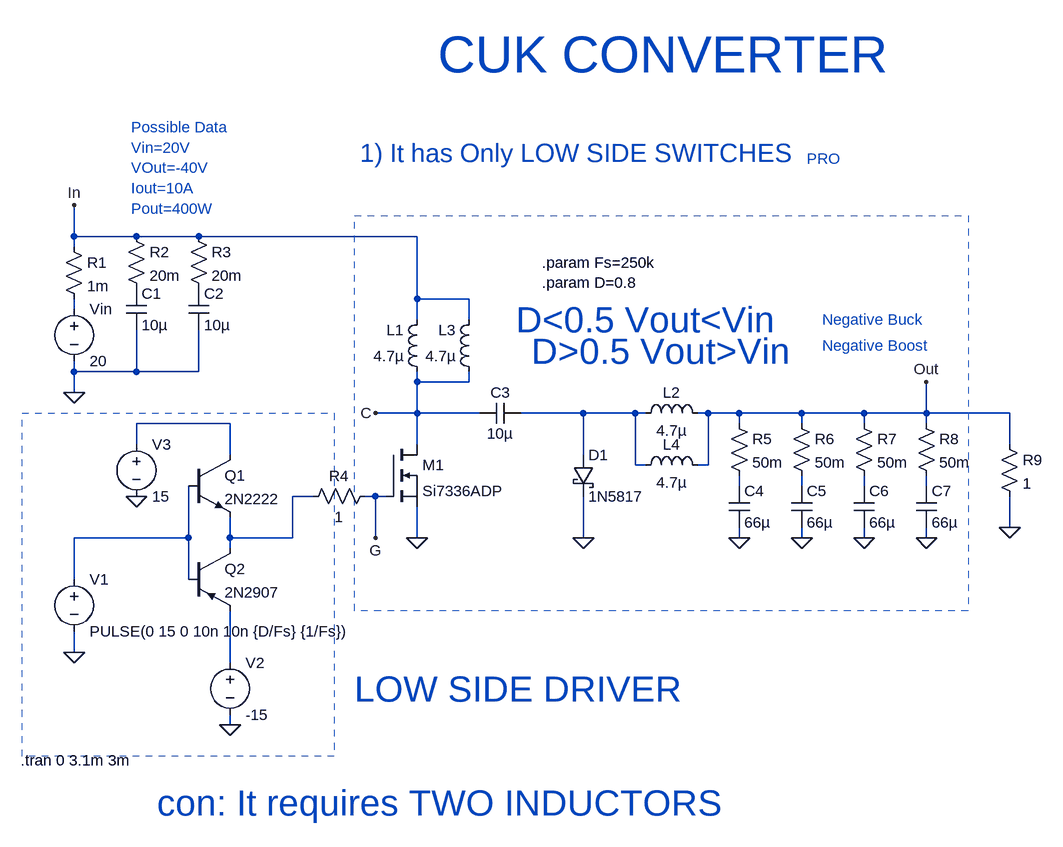
[diagram p0: schematic Cuk Converter.asc]
Cuk Converter.asc, the LTspice schematic file:
Version 4
SHEET 1 1416 940
WIRE -112 32 -112 -16
WIRE -16 32 -112 32
WIRE 80 32 -16 32
WIRE 416 32 80 32
WIRE -112 48 -112 32
WIRE 416 128 416 32
WIRE 496 128 416 128
WIRE -112 144 -112 128
WIRE 416 160 416 128
WIRE 496 160 496 128
WIRE -112 240 -112 224
WIRE -16 240 -16 176
WIRE -16 240 -112 240
WIRE 80 240 80 176
WIRE 80 240 -16 240
WIRE 416 256 416 240
WIRE 496 256 496 240
WIRE 496 256 416 256
WIRE -112 272 -112 240
WIRE 416 304 416 256
WIRE 416 304 352 304
WIRE 512 304 416 304
WIRE 672 304 576 304
WIRE 752 304 672 304
WIRE 768 304 752 304
WIRE 864 304 848 304
WIRE 912 304 864 304
WIRE 1008 304 912 304
WIRE 1104 304 1008 304
WIRE 1200 304 1200 256
WIRE 1200 304 1104 304
WIRE 1328 304 1200 304
WIRE 128 320 -16 320
WIRE 912 320 912 304
WIRE 1008 320 1008 304
WIRE 1104 320 1104 304
WIRE 1200 320 1200 304
WIRE -16 352 -16 320
WIRE 416 352 416 304
WIRE 1328 352 1328 304
WIRE 128 368 128 320
WIRE 672 368 672 304
WIRE 752 384 752 304
WIRE 768 384 752 384
WIRE 864 384 864 304
WIRE 864 384 848 384
WIRE 912 416 912 400
WIRE 1008 416 1008 400
WIRE 1104 416 1104 400
WIRE 1200 416 1200 400
WIRE 256 432 224 432
WIRE 352 432 336 432
WIRE 368 432 352 432
WIRE 1328 480 1328 432
WIRE 64 496 64 416
WIRE 64 496 -112 496
WIRE 128 496 128 464
WIRE 224 496 224 432
WIRE 224 496 128 496
WIRE 352 496 352 432
WIRE 416 496 416 448
WIRE 672 496 672 432
WIRE 912 496 912 480
WIRE 1008 496 1008 480
WIRE 1104 496 1104 480
WIRE 1200 496 1200 480
WIRE 128 512 128 496
WIRE -112 560 -112 496
WIRE 64 560 64 496
WIRE -112 672 -112 640
WIRE 128 688 128 608
WIRE 128 784 128 768
FLAG -112 272 0
FLAG -112 -16 In
FLAG 416 496 0
FLAG -112 672 0
FLAG 128 784 0
FLAG -16 432 0
FLAG 672 496 0
FLAG 912 496 0
FLAG 1008 496 0
FLAG 1104 496 0
FLAG 1200 496 0
FLAG 352 304 C
FLAG 1200 256 Out
FLAG 352 496 G
FLAG 1328 480 0
SYMBOL voltage -112 128 R0
SYMATTR InstName Vin
SYMATTR Value 20
SYMBOL res -128 32 R0
SYMATTR InstName R1
SYMATTR Value 1m
SYMBOL cap -32 112 R0
SYMATTR InstName C1
SYMATTR Value 10µ
SYMBOL res -32 16 R0
SYMATTR InstName R2
SYMATTR Value 20m
SYMBOL cap 64 112 R0
SYMATTR InstName C2
SYMATTR Value 10µ
SYMBOL res 64 16 R0
SYMATTR InstName R3
SYMATTR Value 20m
SYMBOL ind 432 256 R180
WINDOW 0 36 80 Left 2
WINDOW 3 36 40 Left 2
SYMATTR InstName L1
SYMATTR Value 4.7µ
SYMBOL nmos 368 352 R0
SYMATTR InstName M1
SYMATTR Value Si7336ADP
SYMBOL voltage -112 544 R0
WINDOW 123 0 0 Left 0
WINDOW 39 0 0 Left 0
SYMATTR InstName V1
SYMATTR Value PULSE(0 15 0 10n 10n {D/Fs} {1/Fs})
SYMBOL npn 64 368 R0
SYMATTR InstName Q1
SYMATTR Value 2N2222
SYMBOL pnp 64 512 R0
SYMATTR InstName Q2
SYMATTR Value 2N2907
SYMBOL voltage 128 672 R0
SYMATTR InstName V2
SYMATTR Value -15
SYMBOL voltage -16 336 R0
SYMATTR InstName V3
SYMATTR Value 15
SYMBOL res 352 416 R90
WINDOW 0 0 56 VBottom 2
WINDOW 3 32 56 VTop 2
SYMATTR InstName R4
SYMATTR Value 1
SYMBOL cap 576 288 R90
WINDOW 0 0 32 VBottom 2
WINDOW 3 32 32 VTop 2
SYMATTR InstName C3
SYMATTR Value 10µ
SYMBOL schottky 656 368 R0
SYMATTR InstName D1
SYMATTR Value 1N5817
SYMATTR Description Diode
SYMATTR Type diode
SYMBOL ind 752 320 R270
WINDOW 0 32 56 VTop 2
WINDOW 3 5 56 VBottom 2
SYMATTR InstName L2
SYMATTR Value 4.7µ
SYMBOL cap 896 416 R0
SYMATTR InstName C4
SYMATTR Value 66µ
SYMBOL res 896 304 R0
SYMATTR InstName R5
SYMATTR Value 50m
SYMBOL cap 992 416 R0
SYMATTR InstName C5
SYMATTR Value 66µ
SYMBOL res 992 304 R0
SYMATTR InstName R6
SYMATTR Value 50m
SYMBOL cap 1088 416 R0
SYMATTR InstName C6
SYMATTR Value 66µ
SYMBOL res 1088 304 R0
SYMATTR InstName R7
SYMATTR Value 50m
SYMBOL cap 1184 416 R0
SYMATTR InstName C7
SYMATTR Value 66µ
SYMBOL res 1184 304 R0
SYMATTR InstName R8
SYMATTR Value 50m
SYMBOL res 1312 336 R0
SYMATTR InstName R9
SYMATTR Value 1
SYMBOL ind 512 256 R180
WINDOW 0 36 80 Left 2
WINDOW 3 36 40 Left 2
SYMATTR InstName L3
SYMATTR Value 4.7µ
SYMBOL ind 752 400 R270
WINDOW 0 32 56 VTop 2
WINDOW 3 5 56 VBottom 2
SYMATTR InstName L4
SYMATTR Value 4.7µ
TEXT -24 -136 Left 2 ;Possible Data\nVin=20V\nVOut=-40V\nIout=10A\nPout=400W
TEXT 608 72 Left 2 !.param Fs=250k\n.param D=0.8
TEXT 448 -248 Left 6 ;CUK CONVERTER
TEXT 320 728 Left 5 ;LOW SIDE DRIVER
TEXT -194 838 Left 2 !.tran 0 3.1m 3m
TEXT 568 160 Left 5 ;D<0.5 Vout<Vin
TEXT 1040 160 Left 2 ;Negative Buck
TEXT 592 208 Left 5 ;D>0.5 Vout>Vin
TEXT 1040 200 Left 2 ;Negative Boost
TEXT 328 -96 Left 4 ;1) It has Only LOW SIDE SWITCHES
TEXT 1016 -88 Left 2 ;PRO
TEXT 16 904 Left 5 ;con: It requires TWO INDUCTORS
RECTANGLE Normal 1264 608 320 0 1
RECTANGLE Normal 288 832 -192 304 1

The netlist it stands for:
* Cuk Converter.asc
Vin N001 0 20
R1 In N001 1m
C1 P001 0 10µ
R2 In P001 20m
C2 P002 0 10µ
R3 In P002 20m
L1 C In 4.7µ
M1 C G 0 0 Si7336ADP
V1 N009 0 PULSE(0 15 0 10n 10n {D/Fs} {1/Fs})
Q1 N003 N009 N008 0 2N2222
Q2 N008 N009 N010 0 2N2907
V2 N010 0 -15
V3 N003 0 15
R4 G N008 1
C3 N002 C 10µ
D1 N002 0 1N5817
L2 N002 Out 4.7µ
C4 N004 0 66µ
R5 Out N004 50m
C5 N005 0 66µ
R6 Out N005 50m
C6 N006 0 66µ
R7 Out N006 50m
C7 N007 0 66µ
R8 Out N007 50m
R9 Out 0 1
L3 C In 4.7µ
L4 N002 Out 4.7µ
.model D D
.lib standard.dio
.model NPN NPN
.model PNP PNP
.lib standard.bjt
.model NMOS NMOS
.model PMOS PMOS
.lib standard.mos
* Possible Data
* Vin=20V
* VOut=-40V
* Iout=10A
* Pout=400W
.param Fs=250k
.param D=0.8
* CUK CONVERTER
* LOW SIDE DRIVER
.tran 0 3.1m 3m
* D<0.5 Vout<Vin
* Negative Buck
* D>0.5 Vout>Vin
* Negative Boost
* 1) It has Only LOW SIDE SWITCHES
* PRO
* con: It requires TWO INDUCTORS
.backanno
.end